# EAGLE schematic Carte_Mere_V2 (EAGLE 9.5.2)
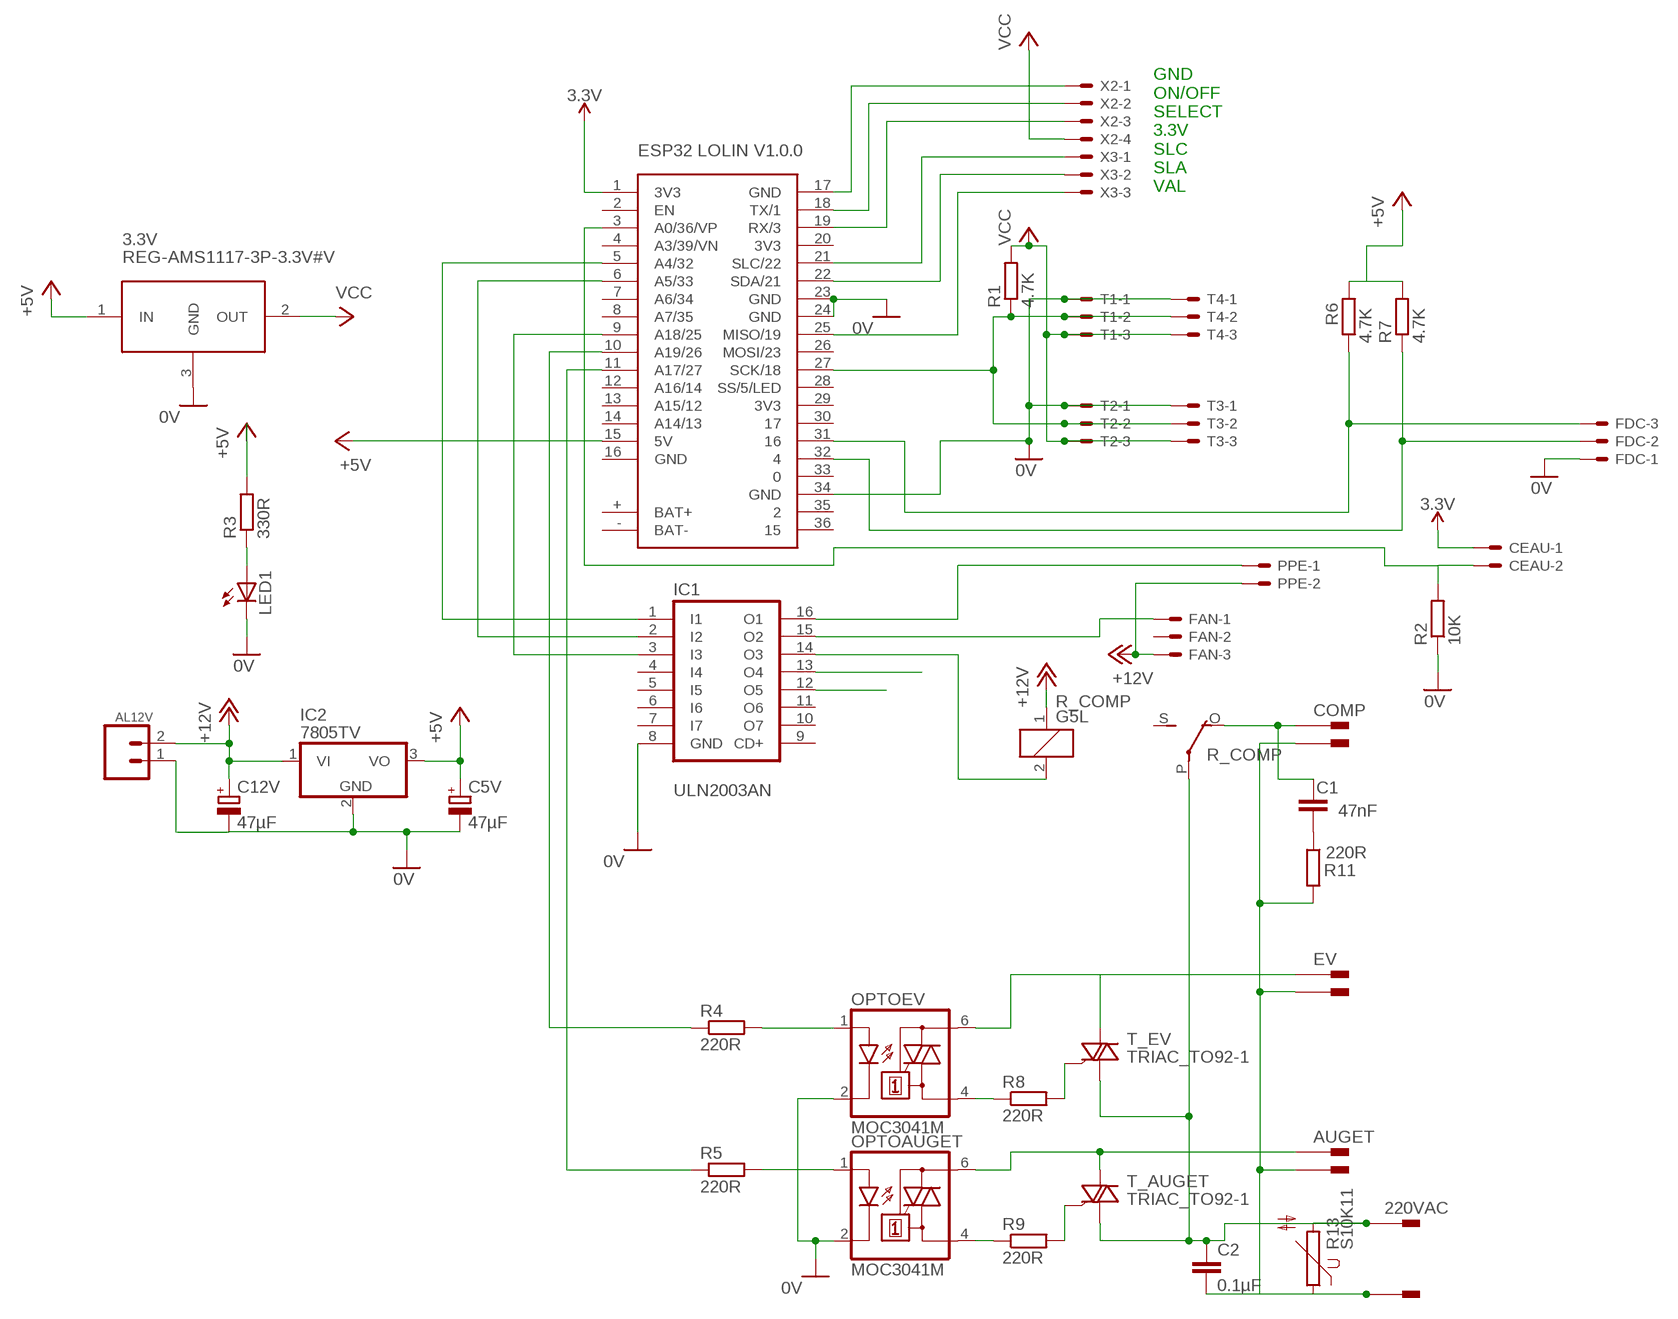
[diagram p0: schematic, sheet 1]

## Parts
3.3V  REG-AMS1117-3P-3.3V#V  [REG-AMS1117-3P#V]
220VAC  PIN2F061.040  [F061.040]
220VAC_N  PIN2F061.040  [F061.040]
AL12V  CONN_025MM  [BORNIER_A_VIS_2_5.12MM]
AUGET  PIN2F061.040  [F061.040]
AUGET_N  PIN2F061.040  [F061.040]
C1  47nF  C10/5  [C10B5]
C2  0.1µF  C15/6  [C15B6]
C5V  47µF  CPOL-EUE2.5-5  [E2,5-5]
C12V  47µF  CPOL-EUE2.5-5  [E2,5-5]
CEAU  JST-XH-02-PIN-LONG-PAD  [JST-XH-02-PACKAGE-LONG-PAD]
COMP  PIN2F061.040  [F061.040]
COMP_N  PIN2F061.040  [F061.040]
EV  PIN2F061.040  [F061.040]
EV_N  PIN2F061.040  [F061.040]
FAN  JST-XH-03-PIN-LONG-PAD  [JST-XH-03-PACKAGE-LONG-PAD]
FDC  JST-XH-03-PIN-LONG-PAD  [JST-XH-03-PACKAGE-LONG-PAD]
IC1  ULN2003AN  [DIL16]
IC2  7805TV  [TO220V]
LED1  LED5MM_F  [LED5MM]
OPTOAUGET  MOC3041M  [DIL06]
OPTOEV  MOC3041M  [DIL06]
PPE  JST-XH-02-PIN-LONG-PAD  [JST-XH-02-PACKAGE-LONG-PAD]
R1  4.7K  R-EU_0207/10  [0207/10]
R2  10K  R-EU_0207/10  [0207/10]
R3  330R  R-EU_0207/10  [0207/10]
R4  220R  R-EU_0204/7  [0204/7]
R5  220R  R-EU_0204/7  [0204/7]
R6  4.7K  R-EU_0207/10  [0207/10]
R7  4.7K  R-EU_0207/10  [0207/10]
R8  220R  R-EU_0204/7  [0204/7]
R9  220R  R-EU_0204/7  [0204/7]
R11  220R  R-EU_0204/7  [0204/7]
R13  S10K11  [S10K11]
R_COMP  G5L  [G5LE]
T1  JST-XH-03-PIN-LONG-PAD  [JST-XH-03-PACKAGE-LONG-PAD]
T2  JST-XH-03-PIN-LONG-PAD  [JST-XH-03-PACKAGE-LONG-PAD]
T3  JST-XH-03-PIN-LONG-PAD  [JST-XH-03-PACKAGE-LONG-PAD]
T4  JST-XH-03-PIN-LONG-PAD  [JST-XH-03-PACKAGE-LONG-PAD]
T_AUGET  TRIAC_TO92-1  [TO92-6]
T_EV  TRIAC_TO92-1  [TO92-6]
U$1  ESP32_LOLIN_V1.0.0  [ESP32_LOLIN_V1.0.0]
X2  JST-XH-04-PIN-LONG-PAD  [JST-XH-04-PACKAGE-LONG-PAD]
X3  JST-XH-03-PIN-LONG-PAD  [JST-XH-03-PACKAGE-LONG-PAD]

## Nets
0V: 3.3V.3(GND) AL12V.1 C5V.V- C12V.V- FDC.1 IC1.8(GND) IC2.2(GND) LED1.K(C) OPTOAUGET.2(C) OPTOEV.2(C) R2.1 T1.1 T2.1 T3.1 T4.1 U$1.23(GND) U$1.24(GND) U$1.34(GND)
3.3V: CEAU.1 U$1.1(3V3)
+5V: 3.3V.1(IN) C5V.V+ IC2.3(VO) R3.2 R6.2 R7.2 U$1.15(5V)
+12V: AL12V.2 C12V.V+ FAN.3 IC2.1(VI) PPE.2 R_COMP.1
N$1: U$1.21(SLC/22) X3.1
N$2: EV.A1 EV.A2 OPTOEV.6(A2) T_EV.A2
N$3: IC1.1(I1) U$1.5(A4/32)
N$4: FDC.2 R7.1 U$1.32
N$5: IC1.2(I2) U$1.6(A5/33)
N$6: C1.1 R11.1
N$7: LED1.A R3.1
N$8: IC1.16(O1) PPE.1
N$9: FAN.1 IC1.15(O2)
N$10: IC1.14(O3) R_COMP.2
N$11: IC1.3(I3) U$1.9(A18/25)
N$12: R4.1 U$1.10(A19/26)
N$13: R5.1 U$1.11(A17/27)
N$14: IC1.13(O4)
N$15: OPTOEV.1(A) R4.2
N$16: AUGET.A1 AUGET.A2 OPTOAUGET.6(A2) T_AUGET.A2
N$17: U$1.22(SDA/21) X3.2
N$18: OPTOEV.4(A1) R8.1
N$19: C1.2 COMP.A1 COMP.A2 R_COMP.O(2:O)
N$20: IC1.12(O5)
N$21: OPTOAUGET.1(A) R5.2
N$22: U$1.17(GND) X2.1
N$23: FDC.3 R6.1 U$1.31
N$24: U$1.18(TX/1) X2.2
N$25: U$1.19(RX/3) X2.3
N$27: U$1.25(MISO/19) X3.3
N$28: CEAU.2 R2.2 U$1.3(A0/36/VP)
N$29: OPTOAUGET.4(A1) R9.1
N$30: R1.1 T1.2 T2.2 T3.2 T4.2 U$1.27(SCK/18)
N$31: R8.2 T_EV.G
N$32: R9.2 T_AUGET.G
N$33: 220VAC.A1 220VAC.A2 C2.1 R13.2 R_COMP.P(2:P) T_AUGET.A1 T_EV.A1
N$35: 220VAC_N.A1 220VAC_N.A2 AUGET_N.A1 AUGET_N.A2 C2.2 COMP_N.A1 COMP_N.A2 EV_N.A1 EV_N.A2 R11.2 R13.1
VCC: 3.3V.2(OUT) R1.2 T1.3 T2.3 T3.3 T4.3 X2.4
Unconnected: FAN.2 IC1.4(I4) IC1.5(I5) IC1.6(I6) IC1.7(I7) IC1.9(CD+) IC1.10(O7) IC1.11(O6) R_COMP.S(2:S) U$1.2(EN) U$1.4(A3/39/VN) U$1.7(A6/34) U$1.8(A7/35) U$1.12(A16/14) U$1.13(A15/12) U$1.14(A14/13) U$1.26(MOSI/23) U$1.28(SS/5/LED) U$1.30 U$1.33 U$1.35 U$1.36

## Notes on the sheet
- GND
  ON/OFF
  SELECT
  3.3V
  SLC
  SLA
  VAL

## Power pins joined to a net without a drawn wire
3V3: U$1.20(3V3) U$1.29(3V3)
BAT+: U$1.+(BAT+)
BAT-: U$1.-(BAT-)
GND: U$1.16(GND)

## Library data of the parts
3.3V = 05-arduino_etc:REG-AMS1117-3P-*: Linear Regulator based on AMS1117 chip 3-pin version AMS1117 datasheet is available here: http://www.advanced-monolithic.com/pdf/ds1117.pdf Click here to find device on ebay.com <http://www.ebay.com/sch/ams1117+module> Note: There are many variants. Search for the proper version.
220VAC 220VAC_N AUGET AUGET_N COMP COMP_N EV EV_N = con-faston:PIN2: Flachstecker Typ Tyco/Electronics/AMP TAB, FASTON Printed Circuit Board Tabs Source: http://www.buerklin.com, http://catalog.tycoelectronics.com; OC_FARNELL: unknown; OC_NEWARK: unknown
AL12V = _Remy:CONN_02: Multi connection point. Often used as Generic Header-pin footprint for 0.1 inch spaced/style header connections On any of the 0.1 inch spaced packages, you can populate with these: Break Away Headers - Straight <https://www.sparkfun.com/products/116> (PRT-00116) Break Away Male Headers - Right Angle <https://www.sparkfun.com/products/553> (PRT-00553) Female Headers <https://www.sparkfun.com/products/115> (PRT-00115) Break Away Headers - Machine Pin <https://www.sparkfun.com/products/117> (PRT-00117) Break Away Female Headers - Swiss Machine Pin <https://www.sparkfun.com/products/743> (PRT-00743) For SCREWTERMINALS and SPRING TERMINALS visit here: Screw Terimnals on SparkFun.com <https://www.sparkfun.com/search/results?term=Screw+Terminals> (5mm/3.5mm/2.54mm spacing) This device is also useful as a general connection point to wire up your design to another part of your project. Our various solder wires solder well into these plated through hole pads. Hook-Up Wire - Assortment (Stranded, 22 AWG) <https://www.sparkfun.com/products/11375> (PRT-11375) Hook-Up Wire - Assortment (Solid Core, 22 AWG) <https://www.sparkfun.com/products/11367> (PRT-11367) View the entire wire category on our website here <https://www.sparkfun.com/categories/141> Special notes: Molex polarized connector foot print use with: PRT-08233 with associated crimp pins and housings. 2.54_SCREWTERM for use with PRT-10571. 3.5mm Screw Terminal footprints for PRT-08084 5mm Screw Terminal footprints for use with PRT-08432; SF_SKU: PRT-08432
C1 C2 = 00-LIVIO:C: CAPACITOR naming: grid - package width
C5V C12V = 00-LIVIO:CPOL-EU: POLARIZED CAPACITOR, European symbol
CEAU PPE = con-JST XH Connectors v1-0:JST-XH-02-PIN: JST XH Connector 2 Pin Wire to board connector. Pitch: 2,54 mm, (0.100") Number of pins: 2 Created by Rembrandt Electronics www.rembrandtelectronics.com
FAN FDC T1-T4 X3 = con-JST XH Connectors v1-0:JST-XH-03-PIN: JST XH Connector 2 Pin Wire to board connector. Pitch: 2,54 mm, (0.100") Number of pins: 3 Created by Rembrandt Electronics www.rembrandtelectronics.com
IC1 = uln-udn:ULN2003A: DRIVER ARRAY
IC2 = 00-LIVIO:78*: Positive VOLTAGE REGULATOR Source: http://cache.national.com/ds/LM/LM78L05.pdf http://www.fairchildsemi.com/ds/LM/LM7805.pdf
LED1 = _Remy:LED: LEDS
OPTOAUGET OPTOEV = optocoupler:MOC30*: 6-Pin DIP Zero-Cross Optoisolators Triac Driver Output (250/400 Volt Peak) Source: Data sheet <http://www.fairchildsemi.com/ds/MO/MOC3031M.pdf> The old path of data sheet not more available 2013-05-06.; MF: FAIRCHILD SEMICONDUCTOR; MPN: MOC3041M; OC_FARNELL: 1086677; OC_NEWARK: 78K6090
R1-R3 R6 R7 = _Remy:R-EU_: RESISTOR, European symbol
R4 R5 R8 R9 R11 = 00-LIVIO:R-EU_: RESISTOR, European symbol
R13 = varistor:S10K11: VARISTOR
R_COMP = relay:G5L: RELAY 1 x switch, 10 A/120 V AC, 8 A/30 V ADC, Omron; OC_FARNELL: unknown; OC_NEWARK: unknown
T_AUGET T_EV = 04_Remy:TRIAC_TO92-1: TRIAC
U$1 = _Remy:ESP32_LOLIN_V1.0.0
X2 = con-JST XH Connectors v1-0:JST-XH-04-PIN: JST XH Connector 2 Pin Wire to board connector. Pitch: 2,54 mm, (0.100") Number of pins: 4 Created by Rembrandt Electronics www.rembrandtelectronics.com